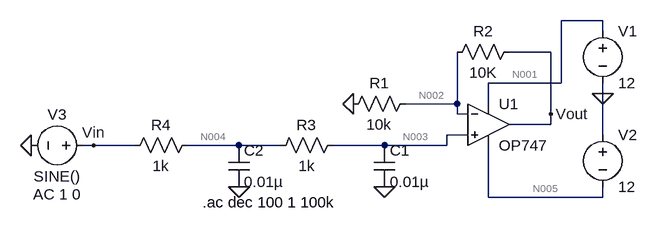
[diagram p0: schematic SO_ACTIVE_LPF.asc]
SO_ACTIVE_LPF.asc, the LTspice schematic file:
Version 4
SHEET 1 880 680
WIRE 336 -32 272 -32
WIRE 336 -16 336 -32
WIRE 256 16 192 16
WIRE 272 64 272 -32
WIRE 272 64 160 64
WIRE 336 80 336 64
WIRE 112 96 112 16
WIRE 112 96 32 96
WIRE 160 96 160 64
WIRE 112 112 112 96
WIRE 128 112 112 112
WIRE 256 112 256 16
WIRE 256 128 256 112
WIRE 256 128 192 128
WIRE 128 144 96 144
WIRE 336 144 336 80
WIRE -448 160 -464 160
WIRE -384 160 -448 160
WIRE -224 160 -304 160
WIRE -160 160 -224 160
WIRE 0 160 -80 160
WIRE 96 160 96 144
WIRE 96 160 0 160
WIRE 160 240 160 160
WIRE 336 240 336 224
WIRE 336 240 160 240
FLAG -48 96 0
FLAG 336 80 0
FLAG 0 224 0
FLAG -544 160 0
FLAG 256 112 Vout
FLAG -448 160 Vin
FLAG -224 224 0
SYMBOL OpAmps\\OP747 160 64 R0
SYMATTR InstName U1
SYMBOL voltage 336 -32 R0
WINDOW 123 0 0 Left 0
WINDOW 39 0 0 Left 0
SYMATTR InstName V1
SYMATTR Value 12
SYMBOL voltage 336 128 R0
WINDOW 123 0 0 Left 0
WINDOW 39 0 0 Left 0
SYMATTR InstName V2
SYMATTR Value 12
SYMBOL res 48 80 R90
WINDOW 0 0 56 VBottom 2
WINDOW 3 32 56 VTop 2
SYMATTR InstName R1
SYMATTR Value 10k
SYMBOL res 208 0 R90
WINDOW 0 0 56 VBottom 2
WINDOW 3 32 56 VTop 2
SYMATTR InstName R2
SYMATTR Value 10K
SYMBOL res -64 144 R90
WINDOW 0 0 56 VBottom 2
WINDOW 3 32 56 VTop 2
SYMATTR InstName R3
SYMATTR Value 1k
SYMBOL cap -16 160 R0
SYMATTR InstName C1
SYMATTR Value 0.01µ
SYMBOL voltage -448 160 R90
WINDOW 0 -32 56 VBottom 2
WINDOW 3 32 56 VTop 2
WINDOW 123 60 56 VTop 2
WINDOW 39 0 0 Left 0
SYMATTR InstName V3
SYMATTR Value SINE()
SYMATTR Value2 AC 1 0
SYMBOL res -288 144 R90
WINDOW 0 0 56 VBottom 2
WINDOW 3 32 56 VTop 2
SYMATTR InstName R4
SYMATTR Value 1k
SYMBOL cap -240 160 R0
SYMATTR InstName C2
SYMATTR Value 0.01µ
TEXT -280 248 Left 2 !.ac dec 100 1 100k

The netlist it stands for:
* SO_ACTIVE_LPF.asc
XU1 N003 N002 N001 N005 Vout OP747  ; pins In+ In- V+ V- OUT
V1 N001 0 12
V2 0 N005 12
R1 N002 0 10k
R2 Vout N002 10K
R3 N003 N004 1k
C1 N003 0 0.01µ
V3 Vin 0 SINE() AC 1 0
R4 N004 Vin 1k
C2 N004 0 0.01µ
.ac dec 100 1 100k
.backanno
.end

* Results of the author's LTspice run, read from the files saved beside the schematic
* Operating Point, zero values left out:
*   V(n002) = 102.1 µV
*   V(n005) = -12 V
*   V(n001) = 12 V
*   V(n003) = 22.14 µV
*   V(vout) = 113.6 µV
*   V(n004) = 11.07 µV
*   I(R4) = 11.07 nA
*   I(R3) = 11.07 nA
*   I(R2) = 1.146 nA
*   I(R1) = 10.21 nA
*   I(V3) = 11.07 nA
*   I(V2) = -282.8 µA
*   I(V1) = -282.8 µA
*   Ix(u1:1) = -11.07 nA
*   Ix(u1:2) = -9.068 nA
*   Ix(u1:99) = 282.8 µA
*   Ix(u1:50) = -282.8 µA
*   Ix(u1:45) = -1.146 nA
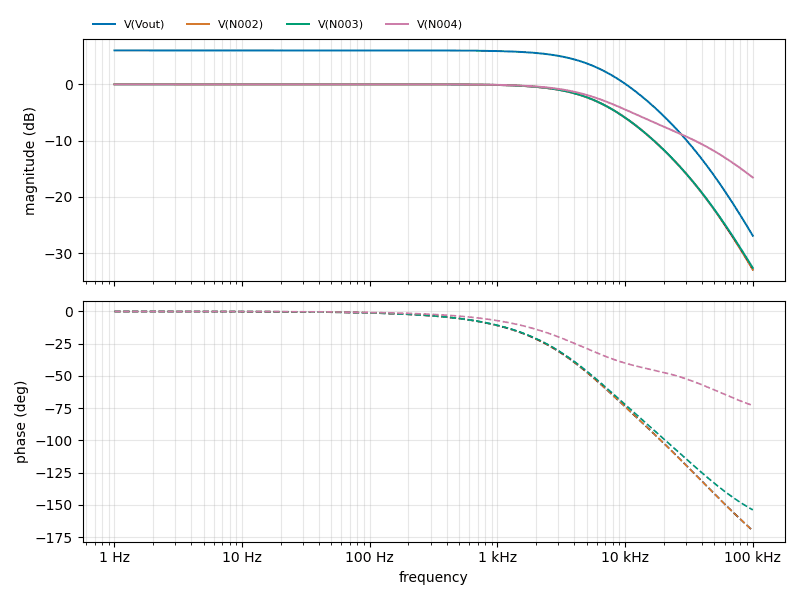
[diagram p1: AC Analysis of SO_ACTIVE_LPF.asc, plotted from the saved traces]
* AC Analysis, 1 run:
*   V(Vout): 6.02 dB at 1 Hz, -26.93 dB at 100 kHz, peak 6.02 dB at 1 Hz, 3 dB below the peak at 5.954 kHz
*   V(N002): -0.00 dB at 1 Hz, -32.95 dB at 100 kHz, peak -0.00 dB at 1 Hz, 3 dB below the peak at 5.954 kHz
*   V(N003): -0.00 dB at 1 Hz, -32.64 dB at 100 kHz, peak -0.00 dB at 1 Hz, 3 dB below the peak at 5.956 kHz
*   V(N004): -0.00 dB at 1 Hz, -16.57 dB at 100 kHz, peak -0.00 dB at 1 Hz, 3 dB below the peak at 6.984 kHz